# EAGLE design arduino_Uno_Rev3-02-TH (EAGLE 8.0.1)
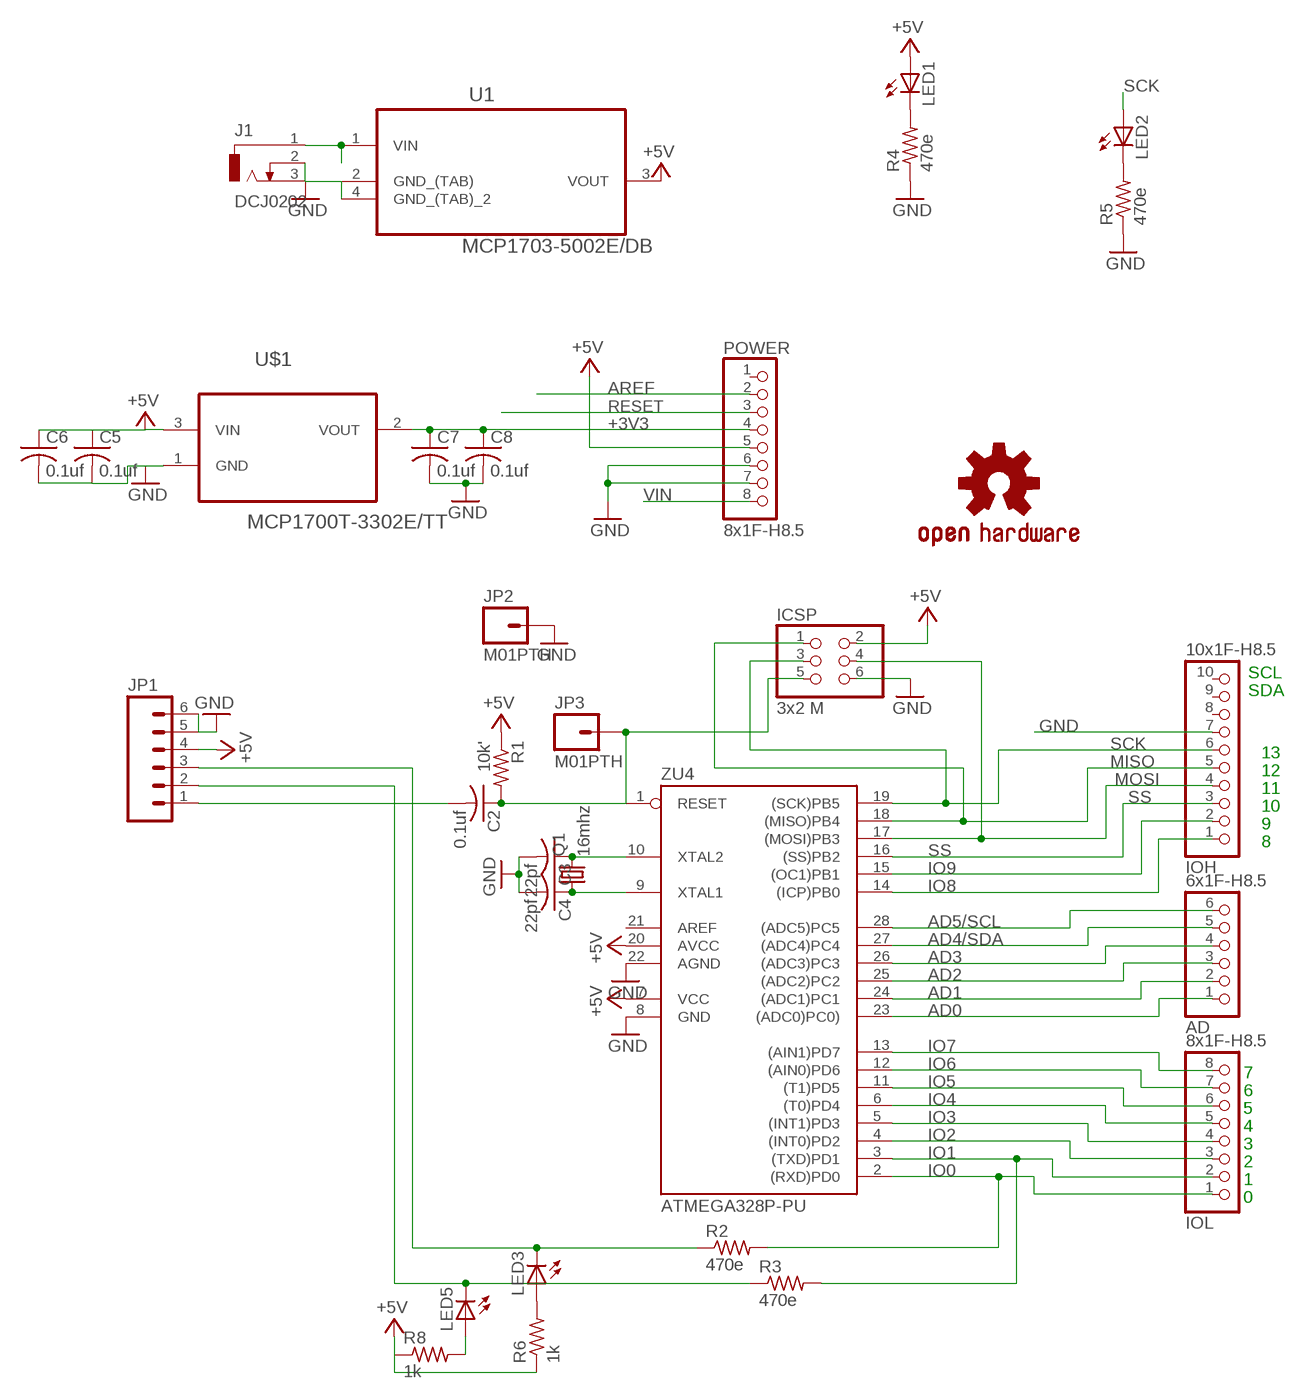
[diagram p0: schematic, sheet 1]

## Parts
AD  6x1F-H8.5  PINHD-1X6  [1X06]
C2  0.1uf  C-USC0603  [C0603]
C3  22pf  C-USC1206  [C1206]
C4  22pf  C-USC1206  [C1206]
C5  0.1uf  C-USC0603  [C0603]
C6  0.1uf  C-USC0603  [C0603]
C7  0.1uf  C-USC0603  [C0603]
C8  0.1uf  C-USC0603  [C0603]
ICSP  3x2 M  PINHD-2X3  [2X03]
IOH  10x1F-H8.5  PINHD-1X10_ARD  [1X10]
IOL  8x1F-H8.5  PINHD-1X8  [1X08]
J1  DCJ0202  [DCJ0202]
JP1  M06LONGPADS  [1X06_LONGPADS]
JP2  M01PTH  [1X01]
JP3  M01PTH  [1X01]
LED1  LED3MM  [LED3MM]
LED2  LED3MM  [LED3MM]
LED3  LED3MM  [LED3MM]
LED5  LED3MM  [LED3MM]
LOGO1  OSHW-LOGOL  [OSHW-LOGO-L]
POWER  8x1F-H8.5  PINHD-1X8  [1X08]
Q1  16mhz  CRYSTALHC49S  [HC49/S]
R1  10k'  R-US_R0603  [R0603]
R2  470e  R-US_R0603  [R0603]
R3  470e  R-US_R0603  [R0603]
R4  470e  R-US_R0603  [R0603]
R5  470e  R-US_R0603  [R0603]
R6  1k  R-US_R0603  [R0603]
R8  1k  R-US_R0603  [R0603]
U1  MCP1703-5002E/DB  [SOT230P700X180-4N]
U$1  MCP1700T-3302E/TT  [SOT95P237X112-3N]
ZU4  ATMEGA328P-PU  [DIL28-3]

## Nets
+3V3: C7.1 C8.1 POWER.4 U$1.2(VOUT)
+5V [usbvcc]: C5.1 C6.1 ICSP.2 JP1.4 LED1.A POWER.5 R1.1 R6.1 R8.1 U1.3(VOUT) U$1.3(VIN) ZU4.7(VCC) ZU4.20(AVCC)
AD0: AD.1 ZU4.23((ADC0)PC0))
AD1: AD.2 ZU4.24((ADC1)PC1)
AD2: AD.3 ZU4.25((ADC2)PC2)
AD3: AD.4 ZU4.26((ADC3)PC3)
AD4/SDA: AD.5 ZU4.27((ADC4)PC4)
AD5/SCL: AD.6 ZU4.28((ADC5)PC5)
AREF [aref]: POWER.2
GND [gnd]: C3.2 C4.2 C5.2 C6.2 C7.2 C8.2 ICSP.6 IOH.7 J1.2 J1.3 JP1.5 JP1.6 JP2.1 POWER.6 POWER.7 R4.1 R5.1 U1.2(GND_(TAB)) U1.4(GND_(TAB)_2) U$1.1(GND) ZU4.8(GND) ZU4.22(AGND)
IO0: IOL.1 R2.2 ZU4.2((RXD)PD0)
IO1: IOL.2 R3.2 ZU4.3((TXD)PD1)
IO2: IOL.3 ZU4.4((INT0)PD2)
IO3: IOL.4 ZU4.5((INT1)PD3)
IO4: IOL.5 ZU4.6((T0)PD4)
IO5: IOL.6 ZU4.11((T1)PD5)
IO6: IOL.7 ZU4.12((AIN0)PD6)
IO7: IOL.8 ZU4.13((AIN1)PD7)
IO8: IOH.1 ZU4.14((ICP)PB0)
IO9: IOH.2 ZU4.15((OC1)PB1)
MISO: ICSP.1 IOH.5 ZU4.18((MISO)PB4)
MOSI: ICSP.4 IOH.4 ZU4.17((MOSI)PB3)
N$1: LED1.K(C) R4.2
N$2: C3.1 Q1.2 ZU4.10(XTAL2)
N$3: C4.1 Q1.1 ZU4.9(XTAL1)
N$4: C2.2 JP1.1
N$5: LED2.K(C) R5.2
N$6: LED5.A R8.2
N$7: LED3.A R6.2
RESET: C2.1 ICSP.5 JP3.1 POWER.3 R1.2 ZU4.1(RESET)
RX_: JP1.3 LED3.K(C) R2.1
SCK: ICSP.3 IOH.6 LED2.A ZU4.19((SCK)PB5)
SS: IOH.3 ZU4.16((SS)PB2)
TX_: JP1.2 LED5.K(C) R3.1
VIN [power]: J1.1 POWER.8 U1.1(VIN)
Unconnected: IOH.8 IOH.9 IOH.10 POWER.1 ZU4.21(AREF)

## Notes on the sheet
- SCL
- SDA
- 13
- 12
- 11
- 10
- 9
- 8
- 7
- 6
- 5
- 4
- 3
- 2
- 1
- 0

## Library data of the parts
AD = SmartPrj:PINHD-1X6: PIN HEADER
C2-C8 = rcl:C-US: CAPACITOR, American symbol
ICSP = SmartPrj:PINHD-2X3: PIN HEADER
IOH = SmartPrj:PINHD-1X10_ARD: PIN HEADER
IOL POWER = SmartPrj:PINHD-1X8: PIN HEADER
J1 = con-jack:DCJ0202: DC POWER JACK Source: DCJ0202.pdf; OC_FARNELL: unknown; OC_NEWARK: unknown
JP1 = SparkFun-Connectors:M06: Header 6 Standard 6-pin 0.1" header. Use with straight break away headers (SKU : PRT-00116), right angle break away headers (PRT-00553), swiss pins (PRT-00743), machine pins (PRT-00117), and female headers (PRT-00115). Molex polarized connector foot print use with SKU : PRT-08094 with associated crimp pins and housings. NOTES ON THE VARIANTS LOCK and LOCK_LONGPADS... This footprint was designed to help hold the alignment of a through-hole component (i.e. 6-pin header) while soldering it into place. You may notice that each hole has been shifted either up or down by 0.005 of an inch from it's more standard position (which is a perfectly straight line). This slight alteration caused the pins (the squares in the middle) to touch the edges of the holes. Because they are alternating, it causes a "brace" to hold the component in place. 0.005 has proven to be the perfect amount of "off-center" position when using our standard breakaway headers. Although looks a little odd when you look at the bare footprint, once you have a header in there, the alteration is very hard to notice. Also,if you push a header all the way into place, it is covered up entirely on the bottom side. This idea of altering the position of holes to aid alignment will be further integrated into the Sparkfun Library for other footprints. It can help hold any component with 3 or more connection pins.
JP2 JP3 = SparkFun-Connectors:M01: Header 1 Standard 1-pin 0.1" header. Use with straight break away headers (SKU : PRT-00116), right angle break away headers (PRT-00553), swiss pins (PRT-00743), machine pins (PRT-00117), and female headers (PRT-00115).
LED1-LED3 LED5 = led:LED: LED OSRAM: - CHIPLED LG R971, LG N971, LY N971, LG Q971, LY Q971, LO R971, LY R971 LH N974, LH R974 LS Q976, LO Q976, LY Q976 LO Q996 - Hyper CHIPLED LW Q18S LB Q993, LB Q99A, LB R99A - SideLED LS A670, LO A670, LY A670, LG A670, LP A670 LB A673, LV A673, LT A673, LW A673 LH A674 LY A675 LS A676, LA A676, LO A676, LY A676, LW A676 LS A679, LY A679, LG A679 - Hyper Micro SIDELED® LS Y876, LA Y876, LO Y876, LY Y876 LT Y87S - SmartLED LW L88C, LW L88S LB L89C, LB L89S, LG L890 LS L89K, LO L89K, LY L89K LS L896, LA L896, LO L896, LY L896 - TOPLED LS T670, LO T670, LY T670, LG T670, LP T670 LSG T670, LSP T670, LSY T670, LOP T670, LYG T670 LG T671, LOG T671, LSG T671 LB T673, LV T673, LT T673, LW T673 LH T674 LS T676, LA T676, LO T676, LY T676, LB T676, LH T676, LSB T676, LW T676 LB T67C, LV T67C, LT T67C, LS T67K, LO T67K, LY T67K, LW E67C LS E67B, LA E67B, LO E67B, LY E67B, LB E67C, LV E67C, LT E67C LW T67C LS T679, LY T679, LG T679 LS T770, LO T770, LY T770, LG T770, LP T770 LB T773, LV T773, LT T773, LW T773 LH T774 LS E675, LA E675, LY E675, LS T675 LS T776, LA T776, LO T776, LY T776, LB T776 LHGB T686 LT T68C, LB T68C - Hyper Mini TOPLED® LB M676 - Mini TOPLED Santana® LG M470 LS M47K, LO M47K, LY M47K Source: http://www.osram.convergy.de LUXEON: - LUMILED® LXK2-PW12-R00, LXK2-PW12-S00, LXK2-PW14-U00, LXK2-PW14-V00 LXK2-PM12-R00, LXK2-PM12-S00, LXK2-PM14-U00 LXK2-PE12-Q00, LXK2-PE12-R00, LXK2-PE12-S00, LXK2-PE14-T00, LXK2-PE14-U00 LXK2-PB12-K00, LXK2-PB12-L00, LXK2-PB12-M00, LXK2-PB14-N00, LXK2-PB14-P00, LXK2-PB14-Q00 LXK2-PR12-L00, LXK2-PR12-M00, LXK2-PR14-Q00, LXK2-PR14-R00 LXK2-PD12-Q00, LXK2-PD12-R00, LXK2-PD12-S00 LXK2-PH12-R00, LXK2-PH12-S00 LXK2-PL12-P00, LXK2-PL12-Q00, LXK2-PL12-R00 Source: www.luxeon.com KINGBRIGHT: KA-3528ASYC Source: www.kingbright.com
LOGO1 = SparkFun-Aesthetics:OSHW-LOGO: Open Source Hardware Logo This logo indicates the piece of hardware it is found on incorporates a OSHW license and/or adheres to the definition of open source hardware found here: http://freedomdefined.org/OSHW
Q1 = crystal:CRYSTAL: CRYSTAL; OC_FARNELL: 1667008; OC_NEWARK: unknown
R1-R6 R8 = rcl:R-US_: RESISTOR, American symbol
U1 = Microchip_By_element14_Batch_1:MCP1703-5002E/DB: IC, LDO REG, 250MA, 5V; MPN: MCP1703-5002E/DB; OC_FARNELL: 1627178; OC_NEWARK: 40M0624; PACKAGE: SOT-223-3; SUPPLIER: Microchip
U$1 = Microchip_By_element14_Batch_1:MCP1700T-3302E/TT: Low Quiescent Current LDO; MPN: MCP1700T-3302E/TT; OC_FARNELL: 1296592; OC_NEWARK: 88H9817; PACKAGE: SOT23-3; SUPPLIER: Microchip
ZU4 = SmartPrj:ATMEGA328P-: MICROCONTROLLER 4 Kbytes FLASH 128 bytes SRAM 256 bytes EEPROM UART 6-channel 10 bit ADC

## Net classes
1 power: width 0.61 mm, drill 0.61 mm, clearance 0.254 mm
2 gnd: width 0.305 mm, drill 0.559 mm, clearance 0.254 mm
3 usbvcc: width 0.508 mm, drill 0.61 mm, clearance 0.254 mm
4 aref: width 0.406 mm, drill 0.61 mm, clearance 0.254 mm

## Board
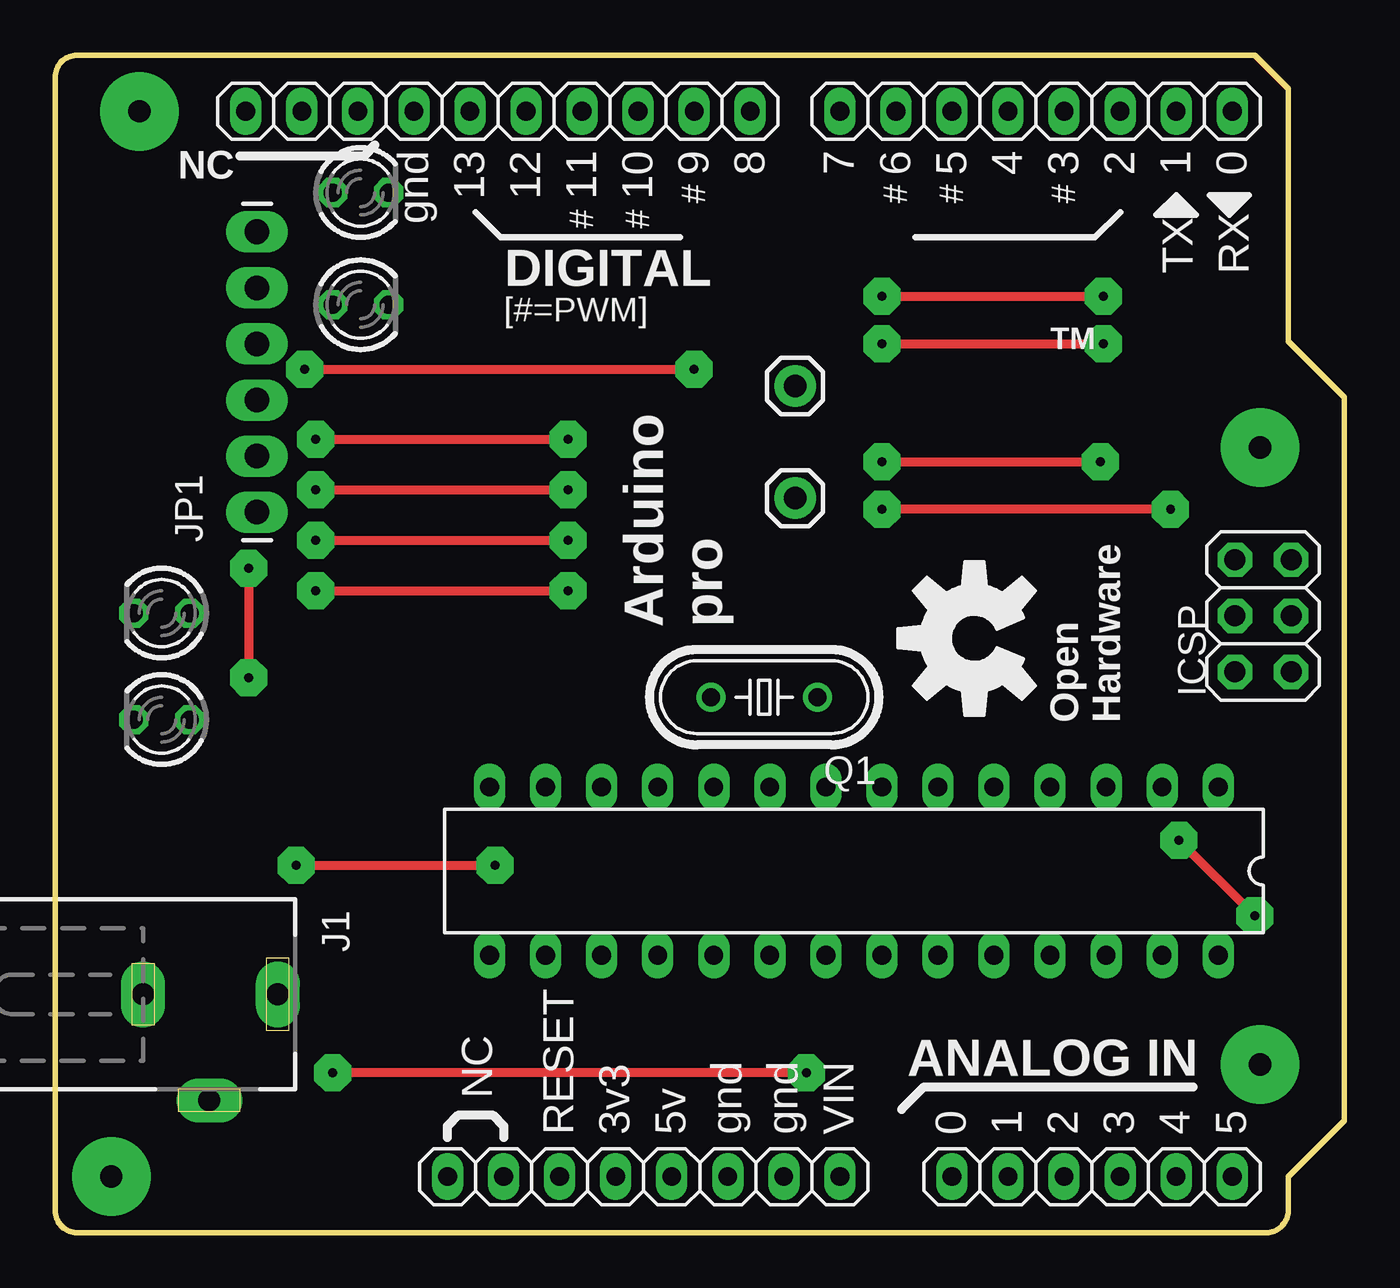
[diagram p1: board, top side]
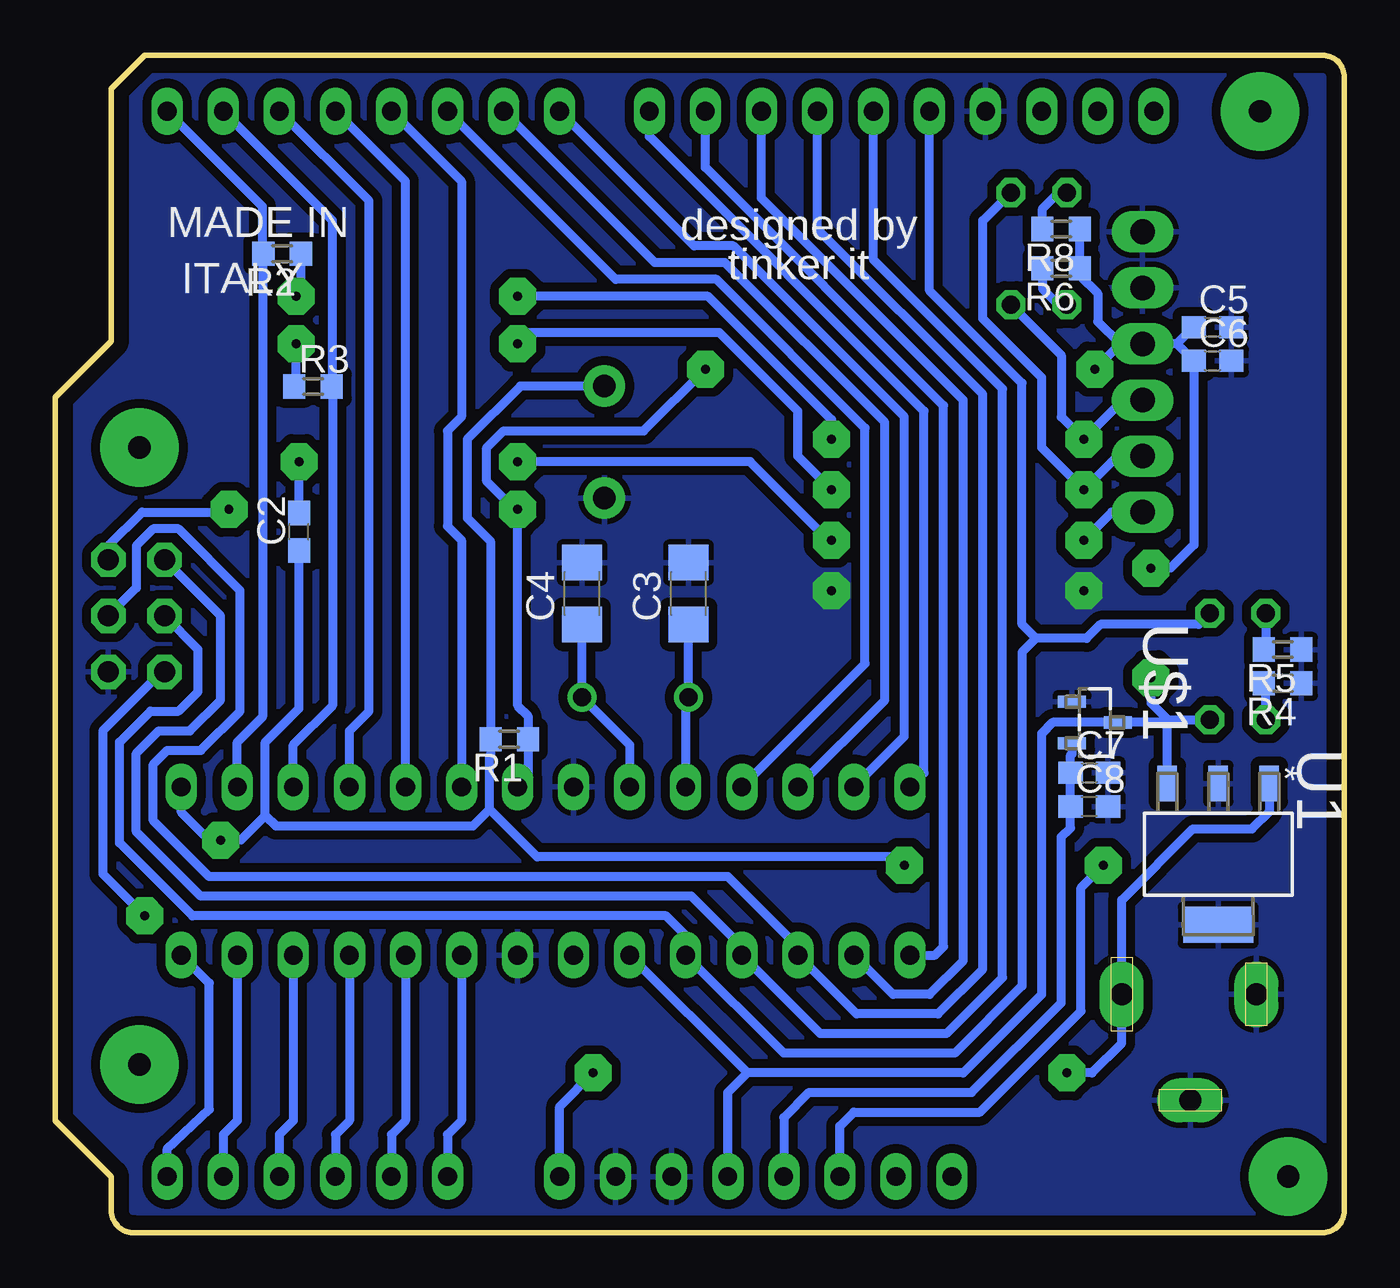
[diagram p2: board, bottom side, seen from below]

Size 58.42 x 53.34 mm. Coordinates in mm from the lower left corner, seen from the top.
Outline: 54.36,53.34 55.88,51.82 55.88,40.39 58.42,37.85 58.42,5.08 55.88,2.54 55.88,1 arc-90 54.88,0 1,0 arc-90 0,1 0,52.34 arc-90 1,53.34 54.36,53.34
Copper layers (1*16): Top 0.035mm / dielectric 1.5mm / Bottom 0.035mm
Design rules "default *": minimum track width 5mil, minimum drill 6mil, track to track 10mil, track to pad 10mil, pad to pad 10mil, via to via 12mil, smd to smd 8mil, copper to edge 26mil, drill to drill 12mil, minimum pad ring 10mil, minimum via ring 10mil, stop-mask expansion 1mil, vias tented up to drill 30mil, thermal gap 10mil
vRestrict: area 11.4,44.1 to 13.2,49.1; area 14,45.5 to 15.6,49.1; area 17,45.3 to 18.2,48.8; area 19.6,45.3 to 20.7,48.8; area 22.1,45.3 to 23.2,48.8; area 24.6,45.3 to 25.8,48.8; area 27.3,47.2 to 28.4,48.8; area 28.8,45.1 to 36.2,46.9; area 48.9,44.2 to 50.3,46.7; area 51.4,44.2 to 52.8,46.7; area 49.9,35.8 to 53.3,37.2; area -10.8,21.8 to -9.4,30.1; 14 more areas

### Footprints (pad centres in the part's own frame; a part is rotated, then mirrored left to right if it is on the bottom)
1X06 = drill 0.85 pad 1.422 long: 1 -6.35,0; 2 -3.81,0; 3 -1.27,0; 4 1.27,0; 5 3.81,0; 6 6.35,0
C0603 = smd 1.1 x 1: 1 -0.85,0; 2 0.85,0
C1206 = smd 1.6 x 1.8: 1 -1.4,0; 2 1.4,0
2X03 = drill 0.95 pad 1.55 octagon: 1 -2.54,-1.27; 2 -2.54,1.27; 3 0,-1.27; 4 0,1.27; 5 2.54,-1.27; 6 2.54,1.27
1X10 = drill 0.85 pad 1.422 long: 1 -11.43,0; 2 -8.89,0; 3 -6.35,0; 4 -3.81,0; 5 -1.27,0; 6 1.27,0; 7 3.81,0; 8 6.35,0; 9 8.89,0; 10 11.43,0
1X08 = drill 0.85 pad 1.422 long: 1 -8.89,0; 2 -6.35,0; 3 -3.81,0; 4 -1.27,0; 5 1.27,0; 6 3.81,0; 7 6.35,0; 8 8.89,0
DCJ0202 = drill 1 pad 2 long: 1 0,3.1; 2 4.8,0; 3 0,-3
1X06_LONGPADS = drill 1.118 pad 1.88 long: 1 0,0; 2 2.54,0; 3 5.08,0; 4 7.62,0; 5 10.16,0; 6 12.7,0
1X01 = drill 1.016 pad 1.88: 1 0,0
LED3MM = drill 0.813 octagon: A -1.27,0; K 1.27,0
HC49/S = drill 0.813: 1 -2.413,0; 2 2.413,0
R0603 = smd 1 x 1.1: 1 -0.85,0; 2 0.85,0
SOT230P700X180-4N = smd 1.626 x 0.889: 1 -3.2,2.311; 2 -3.2,0; 3 -3.2,-2.311 | smd 1.626 x 3.175: 4 3.2,0
SOT95P237X112-3N = smd 0.559 x 1.27: 1 -0.94,-1.041; 2 0.94,-1.041; 3 0,1.041
DIL28-3 = drill 0.85 pad 1.422 long: 1 -16.51,-3.81; 2 -13.97,-3.81; 3 -11.43,-3.81; 4 -8.89,-3.81; 5 -6.35,-3.81; 6 -3.81,-3.81; 7 -1.27,-3.81; 8 1.27,-3.81; 9 3.81,-3.81; 10 6.35,-3.81; 11 8.89,-3.81; 12 11.43,-3.81; 13 13.97,-3.81; 14 16.51,-3.81; 15 16.51,3.81; 16 13.97,3.81; 17 11.43,3.81; 18 8.89,3.81; 19 6.35,3.81; 20 3.81,3.81; 21 1.27,3.81; 22 -1.27,3.81; 23 -3.81,3.81; 24 -6.35,3.81; 25 -8.89,3.81; 26 -11.43,3.81; 27 -13.97,3.81; 28 -16.51,3.81

### Placement (x,y rotation side)
AD  46.99,2.54 0 top
C2  47.37,31.75 90 bottom
C3  29.72,28.96 90 bottom
C4  34.54,28.96 90 bottom
C5  5.97,41.02 0 bottom
C6  5.97,39.5 0 bottom
C7  11.56,20.83 0 bottom
C8  11.56,19.3 0 bottom
ICSP  54.74,27.94 270 top
IOH  20.07,50.8 180 top
IOL  44.45,50.8 180 top
J1  6.98,10.79 270 top
JP1  9.14,32.64 90 top
JP2  33.53,33.27 90 top
JP3  33.53,38.35 90 top
LED1  4.83,23.24 180 top
LED2  4.83,28.07 180 top
LED3  13.84,42.04 0 top
LED5  13.84,47.12 0 top
LOGO1  41.66,26.92 90 top
POWER  26.67,2.54 0 top
Q1  32.13,24.26 180 top
R1  37.85,22.35 180 bottom
R2  48.13,44.35 180 bottom
R3  46.74,38.33 0 bottom
R4  2.79,24.89 180 bottom
R5  2.79,26.42 180 bottom
R6  12.83,43.69 180 bottom
R8  12.83,45.47 180 bottom
U1  5.71,17.14 270 bottom
U$1  11.3,23.11 270 bottom
ZU4  36.2,16.38 180 top

### Tracks (layer width: path | path; a pad name or v marks a point on that pad's centre or on a via)
+3V3
  Bottom 0.406: U$1.2 12.34,21.69 12.41,21.63 C7.1 C8.1 12.41,18.33 12.83,17.93 12.83,10.41 16.89,6.35 24.26,6.35 25.4,5.21 POWER.4
+5V  (via drill 0.41 pad 1.68)
  Top 0.406: v8.76,30.1 v8.76,25.15 | v50.55,32.77 v37.47,32.77 | v11.3,39.12 v28.96,39.12
  Bottom 0.406: 27.05,7.24 ZU4.20 | 27.05,7.24 17.27,7.24 13.72,10.79 13.72,22.61 13.21,23.11 U$1.3 8.13,23.11 8.03,23.22 | POWER.5 27.94,6.35 27.05,7.24 | 7.58,40.26 JP1.4 10.16,40.26 | 7.58,40.26 C5.1 | 7.58,40.26 C6.1 6.82,31.15 7.87,30.1 v8.76,30.1 | 8,23.24 LED1.A | U1.3 8.03,23.22 | 8.03,23.22 8,23.24 | v8.76,25.15 8.76,24 8,23.24 | ZU4.7 37,20.66 R1.1 37,23.41 37.47,23.88 v37.47,32.77 37.59,32.77 38.86,34.04 38.86,35.56 38.1,36.32 31.75,36.32 v28.96,39.12 | ICSP.2 56.01,31.11 54.48,32.64 50.67,32.64 v50.55,32.77 | 10.16,40.26 v11.3,39.12 | 10.16,40.26 11.18,41.27 11.18,42.55 11.98,43.35 R6.1 R8.1
AD0
  Bottom 0.406: ZU4.23 40.01,5.08 40.64,4.45 AD.1
AD1
  Bottom 0.406: ZU4.24 42.55,5.08 43.18,4.45 AD.2
AD2
  Bottom 0.406: ZU4.25 45.09,5.08 45.72,4.45 AD.3
AD3
  Bottom 0.406: ZU4.26 47.62,5.08 48.26,4.45 AD.4
AD4/SDA
  Bottom 0.406: ZU4.27 50.16,5.08 50.8,4.45 AD.5
AD5/SCL
  Bottom 0.406: AD.6 53.34,3.81 51.44,5.59 51.44,11.3 ZU4.28
GND  (via drill 0.41 pad 1.68)
  Top 0.406: v11.81,29.08 v23.24,29.08
  pour Bottom (isolate 0.406, rank 2): 0.63,52.7 55.75,52.7 56.01,52.45 56.01,40.51 58.67,37.85 58.67,5.08 56.13,2.54 56.13,0.64 0.89,0.64 0.63,0.89
IO0
  Bottom 0.406: ZU4.2 50.16,22.23 49.02,23.37 49.02,44.45 | 49.02,44.45 49.02,46.48 IOL.1 | R2.2 49.02,44.45
IO1
  Bottom 0.406: ZU4.3 47.62,22.1 45.85,23.88 45.85,38.35 | 45.85,38.35 45.85,45.85 IOL.2 | R3.2 45.86,38.35 45.85,38.35
IO2
  Bottom 0.406: ZU4.4 45.09,22.73 44.2,23.62 44.2,46.74 IOL.3
IO3
  Bottom 0.406: ZU4.5 42.55,47.62 IOL.4
IO4
  Bottom 0.406: IOL.5 40.01,47.62 40.01,36.96 40.64,36.32 40.64,32 40.01,31.37 ZU4.6
IO5
  Bottom 0.406: ZU4.11 21.72,25.78 21.72,36.45 28.45,43.18 33.02,43.18 IOL.6
IO6
  Bottom 0.406: ZU4.12 20.83,24.13 20.83,36.7 28.07,43.94 31.24,43.94 IOL.7
IO7
  Bottom 0.406: ZU4.13 19.94,22.48 19.94,36.96 27.69,44.7 29.46,44.7 IOL.8
IO8
  Bottom 0.406: ZU4.14 19.05,20.83 19.05,37.21 31.5,49.66 IOH.1
IO9
  Bottom 0.406: ZU4.15 18.54,12.57 18.16,12.95 18.16,37.47 28.96,48.26 IOH.2
MISO
  Bottom 0.406: ICSP.1 50.93,27.94 50.93,24.13 52.32,22.73 53.72,22.73 54.74,21.72 54.74,18.16 51.82,15.24 29.59,15.24 27.3,12.95 ZU4.18 23.75,9.02 18.03,9.02 15.49,11.56 15.49,38.23 21.34,44.07 IOH.5
MOSI
  Bottom 0.406: ICSP.4 54.74,29.21 54.74,31.11 53.98,31.88 52.83,31.88 50.04,29.08 50.04,23.62 51.82,21.84 53.34,21.84 53.98,21.21 53.98,18.67 51.44,16.13 27.94,16.13 24.77,12.95 ZU4.17 22.1,9.91 18.41,9.91 16.38,11.94 16.38,37.97 23.88,45.47 IOH.4
N$1
  Bottom 0.406: LED1.K 3.56,24.8 R4.2
N$2
  Bottom 0.406: ZU4.10 29.84,24.13 Q1.2 C3.1
N$3
  Bottom 0.406: ZU4.9 32.38,22.1 Q1.1 C4.1
N$4  (via drill 0.41 pad 1.68)
  Top 0.406: v11.81,31.37 v23.24,31.37 | v37.47,34.92 v47.37,34.92
  Bottom 0.406: JP1.1 10.54,32.64 v11.81,31.37 | v23.24,31.37 23.37,31.37 26.92,34.92 v37.47,34.92 | C2.2 v47.37,34.92
N$5
  Bottom 0.406: LED2.K 3.56,26.5 R5.2
N$6
  Bottom 0.406: LED5.A 12.95,47.12 13.68,46.39 R8.2
N$7
  Bottom 0.406: LED3.A 12.95,42.04 13.68,42.76 R6.2
N$8  (via drill 1.02 pad 3.56)
  other vias: 2.54,2.54
N$9  (via drill 1.02 pad 3.56)
  other vias: 54.61,7.62
N$10  (via drill 1.02 pad 3.56)
  other vias: 54.61,35.56
N$11  (via drill 1.02 pad 3.56)
  other vias: 3.81,50.8
RESET  (via drill 0.41 pad 1.68)
  Top 0.406: v10.92,16.64 v19.94,16.64 | v50.93,17.78 v54.36,14.35
  Bottom 0.406: ZU4.1 52.71,19.05 51.44,17.78 v50.93,17.78 50.01,17.78 48.9,18.9 | C2.1 47.37,23.75 48.9,22.23 48.9,18.9 | POWER.3 22.86,4.83 22.23,5.46 16.51,5.46 11.94,10.03 11.94,15.62 v10.92,16.64 | 38.73,19.18 38.73,21.59 38.7,21.63 R1.2 38.7,31.33 39.75,32.38 39.75,35.94 37.34,38.35 JP3.1 | 38.73,19.18 39.5,18.41 48.41,18.41 48.9,18.9 | 38.73,19.18 36.58,17.02 20.32,17.02 v19.94,16.64 | ICSP.5 53.59,25.4 56.26,22.73 56.26,16.26 v54.36,14.35
RX_  (via drill 0.41 pad 1.68)
  Top 0.406: v11.81,35.94 v23.24,35.94 | v37.47,42.42 v47.5,42.42
  Bottom 0.406: JP1.3 10.03,37.72 v11.81,35.94 12.83,36.96 12.83,39.75 LED3.K | v47.5,42.42 47.28,42.63 R2.1 | v23.24,35.94 23.24,36.83 28.83,42.42 v37.47,42.42
SCK
  Bottom 0.406: ICSP.3 51.94,26.42 51.94,24.51 52.83,23.62 54.1,23.62 55.5,22.23 55.5,17.65 52.2,14.35 30.73,14.35 29.84,13.46 ZU4.19 25.4,8.13 17.65,8.13 14.61,11.18 14.61,26.29 13.97,26.92 | 13.97,26.92 14.61,27.56 14.61,38.48 18.8,42.67 IOH.6 | LED2.A 6.6,27.56 11.05,27.56 11.68,26.92 13.97,26.92
SS
  Bottom 0.406: ZU4.16 20.45,10.79 18.8,10.79 17.27,12.32 17.27,37.72 26.42,46.86 IOH.3
TX_  (via drill 0.41 pad 1.68)
  Top 0.406: v11.81,33.66 v23.24,33.66 | v37.47,40.26 v47.5,40.26
  Bottom 0.406: JP1.2 10.29,35.18 v11.81,33.66 13.72,35.56 13.72,38.73 16.38,41.4 16.38,45.85 LED5.K | R3.1 47.5,38.42 v47.5,40.26 | v23.24,33.66 24.77,35.18 24.77,37.21 28.32,40.77 36.96,40.77 v37.47,40.26
VIN  (via drill 0.41 pad 1.68)
  Top 0.406: v34.04,7.24 v12.57,7.24
  Bottom 0.406: POWER.8 35.56,5.71 v34.04,7.24 | v12.57,7.24 11.43,7.24 10.09,8.58 J1.1 10.09,15.06 6.86,18.29 4.19,18.29 3.4,19.07 U1.1

### Text on the board
tPlace: gnd | 13 | 12 | 11 | 10 | 9 | 8 | 7 | 6 | 5 | 4 | 3 | 2 | 1 | 0 | Arduino / pro | NC | RESET | 3v3 | 5v | gnd | gnd | 0 | 1 | 2 | 3 | 4 | 5
tNames: NC | # | # | # | # | # | # | DIGITAL | TX | RX | [#=PWM] | TM | Open / Hardware | ANALOG IN | VIN
bNames: MADE IN | designed by | MADE IN | ITALY | tinker it | ITALY | designed by | tinker it | ATMEGA328
ReferenceLC: L | TX | ON | RX | PC1 | PC2
214bmp: D:/SmartProjects/Snc/a4_bn_logo2.bmp